# Altium schematic sheet ti-tps61288-junctions-before.SchDoc
size 174 x 142 mm
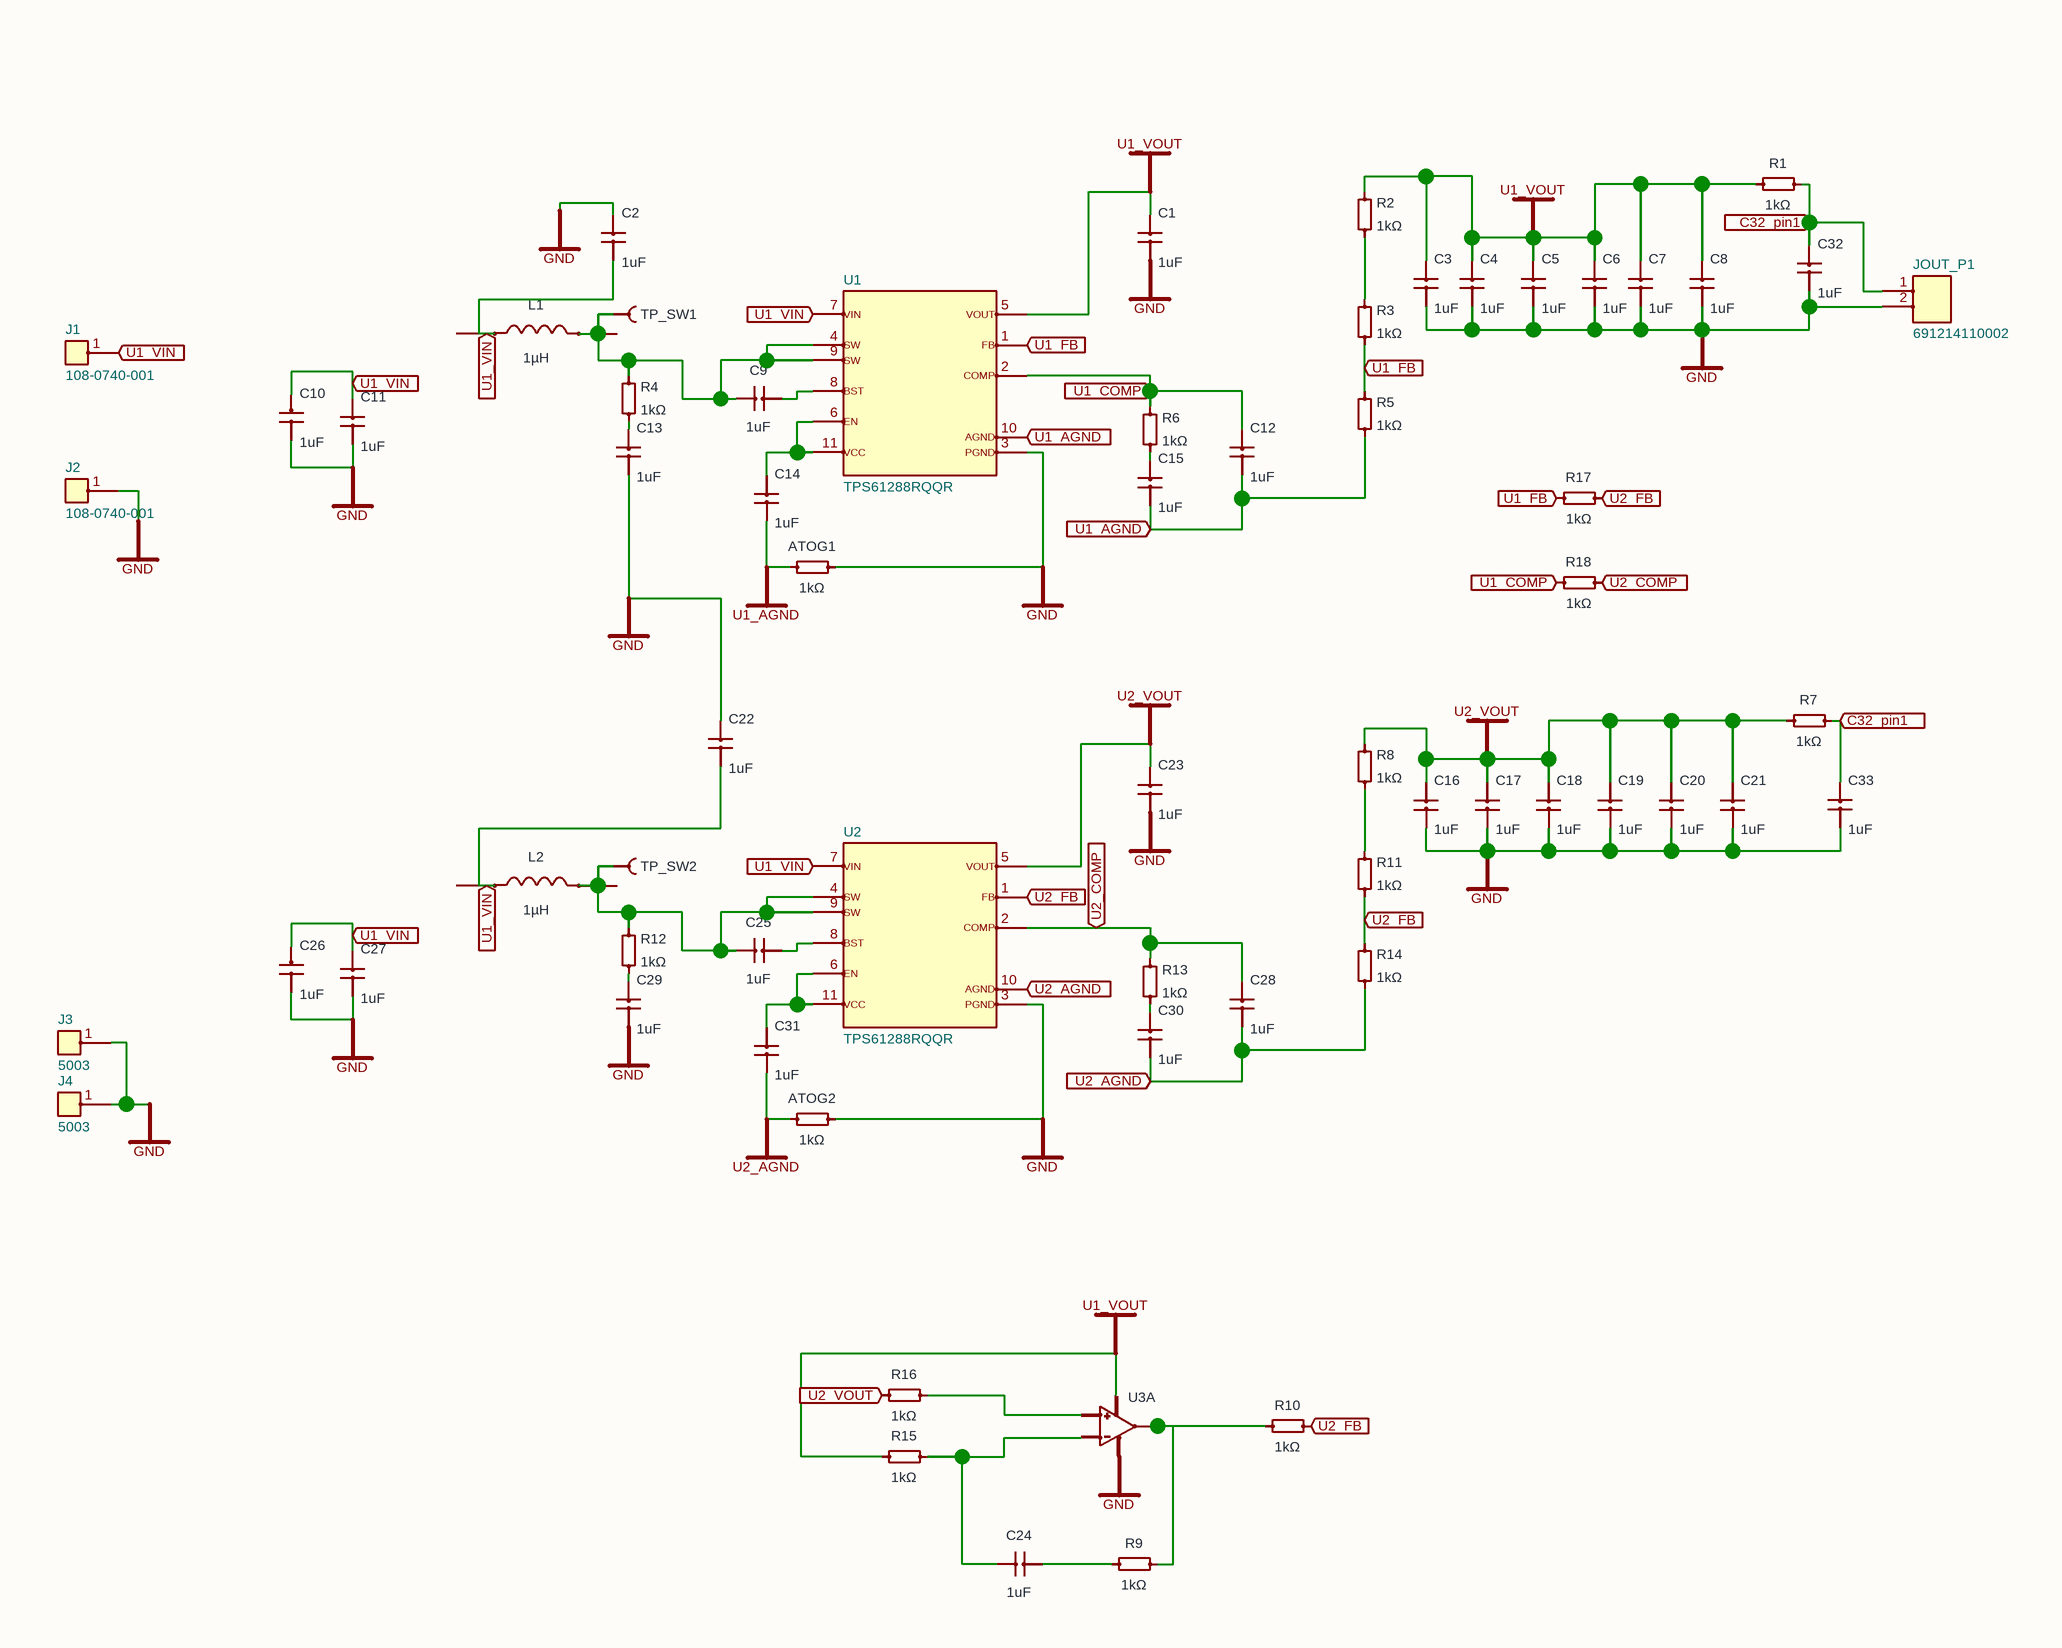
[diagram p0: ti-tps61288-junctions-before.SchDoc]

## Parts
ATOG1  1kΩ
ATOG2  1kΩ
C1  1uF
C2  1uF
C3  1uF
C4  1uF
C5  1uF
C6  1uF
C7  1uF
C8  1uF
C9  1uF
C10  1uF
C11  1uF
C12  1uF
C13  1uF
C14  1uF
C15  1uF
C16  1uF
C17  1uF
C18  1uF
C19  1uF
C20  1uF
C21  1uF
C22  1uF
C23  1uF
C24  1uF
C25  1uF
C26  1uF
C27  1uF
C28  1uF
C29  1uF
C30  1uF
C31  1uF
C32  1uF
C33  1uF
J1  (no value)
J2  (no value)
J3  (no value)
J4  (no value)
JOUT_P1  (no value)
L1  1µH
L2  1µH
R1  1kΩ
R2  1kΩ
R3  1kΩ
R4  1kΩ
R5  1kΩ
R6  1kΩ
R7  1kΩ
R8  1kΩ
R9  1kΩ
R10  1kΩ
R11  1kΩ
R12  1kΩ
R13  1kΩ
R14  1kΩ
R15  1kΩ
R16  1kΩ
R17  1kΩ
R18  1kΩ
TP_SW1  (no value)
TP_SW2  (no value)
U1  (no value)
U2  (no value)
U3A  (no value)

## Nets
GND: ATOG1.1(anode) ATOG2.1(anode) C1.2(cathode) C2.1(anode) C3.2(cathode) C4.2(cathode) C5.2(cathode) C6.2(cathode) C7.2(cathode) C8.2(cathode) C10.2(cathode) C11.2(cathode) C13.2(cathode) C16.1(anode) C17.1(anode) C18.1(anode) C19.1(anode) C20.1(anode) C21.1(anode) C22.1(anode) C23.2(cathode) C26.2(cathode) C27.2(cathode) C29.2(cathode) C32.2(cathode) C33.2(cathode) J2.1 J3.1 J4.1 JOUT_P1.2 U1.3(PGND) U2.3(PGND) U3A.3(V-)
U1_AGND: ATOG1.2(cathode) C12.2(cathode) C14.1(anode) C15.2(cathode) R5.2(cathode) U1.10(AGND)
U1_VOUT: C1.1(anode) C3.1(anode) C4.1(anode) C5.1(anode) C6.1(anode) C7.1(anode) C8.1(anode) R1.1(anode) R2.2(cathode) R15.1(anode) U1.5(VOUT) U3A.5(V+)
U2_AGND: ATOG2.2(cathode) C28.2(cathode) C30.2(cathode) C31.1(anode) R14.2(cathode) U2.10(AGND)
U2_VOUT: C16.2(cathode) C17.2(cathode) C18.2(cathode) C19.2(cathode) C20.2(cathode) C21.2(cathode) C23.1(anode) R7.1(anode) R8.1(anode) R16.1(anode) U2.5(VOUT)
C32_pin1: C32.1(anode) C33.1(anode) JOUT_P1.1 R1.2(cathode) R7.2(cathode)
U1_COMP: C12.1(anode) R6.2(cathode) R18.2(cathode) U1.2(COMP)
U1_FB: R3.1(anode) R5.1(anode) R17.2(cathode) U1.1(FB)
U1_VIN: C2.2(cathode) C10.1(anode) C11.1(anode) C22.2(cathode) C26.1(anode) C27.1(anode) J1.1 L1.1(anode) L2.1(anode) U1.7(VIN) U2.7(VIN)
U2_COMP: C28.1(anode) R13.2(cathode) R18.1(anode) U2.2(COMP)
U2_FB: R10.2(cathode) R11.1(anode) R14.1(anode) R17.1(anode) U2.1(FB)
NetC9_1: C9.1(pos) L1.2(cathode) R4.1(anode) TP_SW1.1(pin1) U1.4(SW) U1.9(SW)
NetC9_2: C9.2(neg) U1.8(BST)
NetC13_1: C13.1(anode) R4.2(cathode)
NetC14_2: C14.2(cathode) U1.6(EN) U1.11(VCC)
NetC15_1: C15.1(anode) R6.1(anode)
NetC24_1: C24.1(pos) R9.1(anode)
NetC24_2: C24.2(neg) R15.2(cathode) U3A.2(inp2)
NetC25_1: C25.1(pos) L2.2(cathode) R12.1(anode) TP_SW2.1(pin1) U2.4(SW) U2.9(SW)
NetC25_2: C25.2(neg) U2.8(BST)
NetC29_1: C29.1(anode) R12.2(cathode)
NetC30_1: C30.1(anode) R13.1(anode)
NetC31_2: C31.2(cathode) U2.6(EN) U2.11(VCC)
NetR2_1: R2.1(anode) R3.2(cathode)
NetR8_2: R8.2(cathode) R11.2(cathode)
NetR9_2: R9.2(cathode) R10.1(anode) U3A.4(out)
NetR16_2: R16.2(cathode) U3A.1(inp1)

## Notes on the sheet
- (in symbol J1) 108-0740-001
- (in symbol J2) 108-0740-001
- (in symbol J3) 5003
- (in symbol J4) 5003
- (in symbol JOUT_P1) 691214110002
- (in symbol U1) TPS61288RQQR
- (in symbol U2) TPS61288RQQR

## Library data of the parts
ATOG1 ATOG2 R17 R18 = boxresistor_left
C1-C8 C10-C13 C15 C22 C23 C26-C30 C32 C33 = capacitor_down
C9 C25 = capacitor_right
C14 C16-C21 C31 = capacitor_up
C24 = capacitor_left
J1 = J1
J2 = J2
J3 = J3
J4 = J4
JOUT_P1 = JOUT_P1
L1 L2 = inductor_right
R1 R7 R9 R10 R15 R16 = boxresistor_right
R2 R3 R6 R11 R13 = boxresistor_up
R4 R5 R8 R12 R14 = boxresistor_down
TP_SW1 TP_SW2 = testpoint_right
U1 = U1
U2 = U2
U3A = opamp_with_power_right